# EAGLE design Lcd16x2_Backpack (EAGLE 9.2.2)
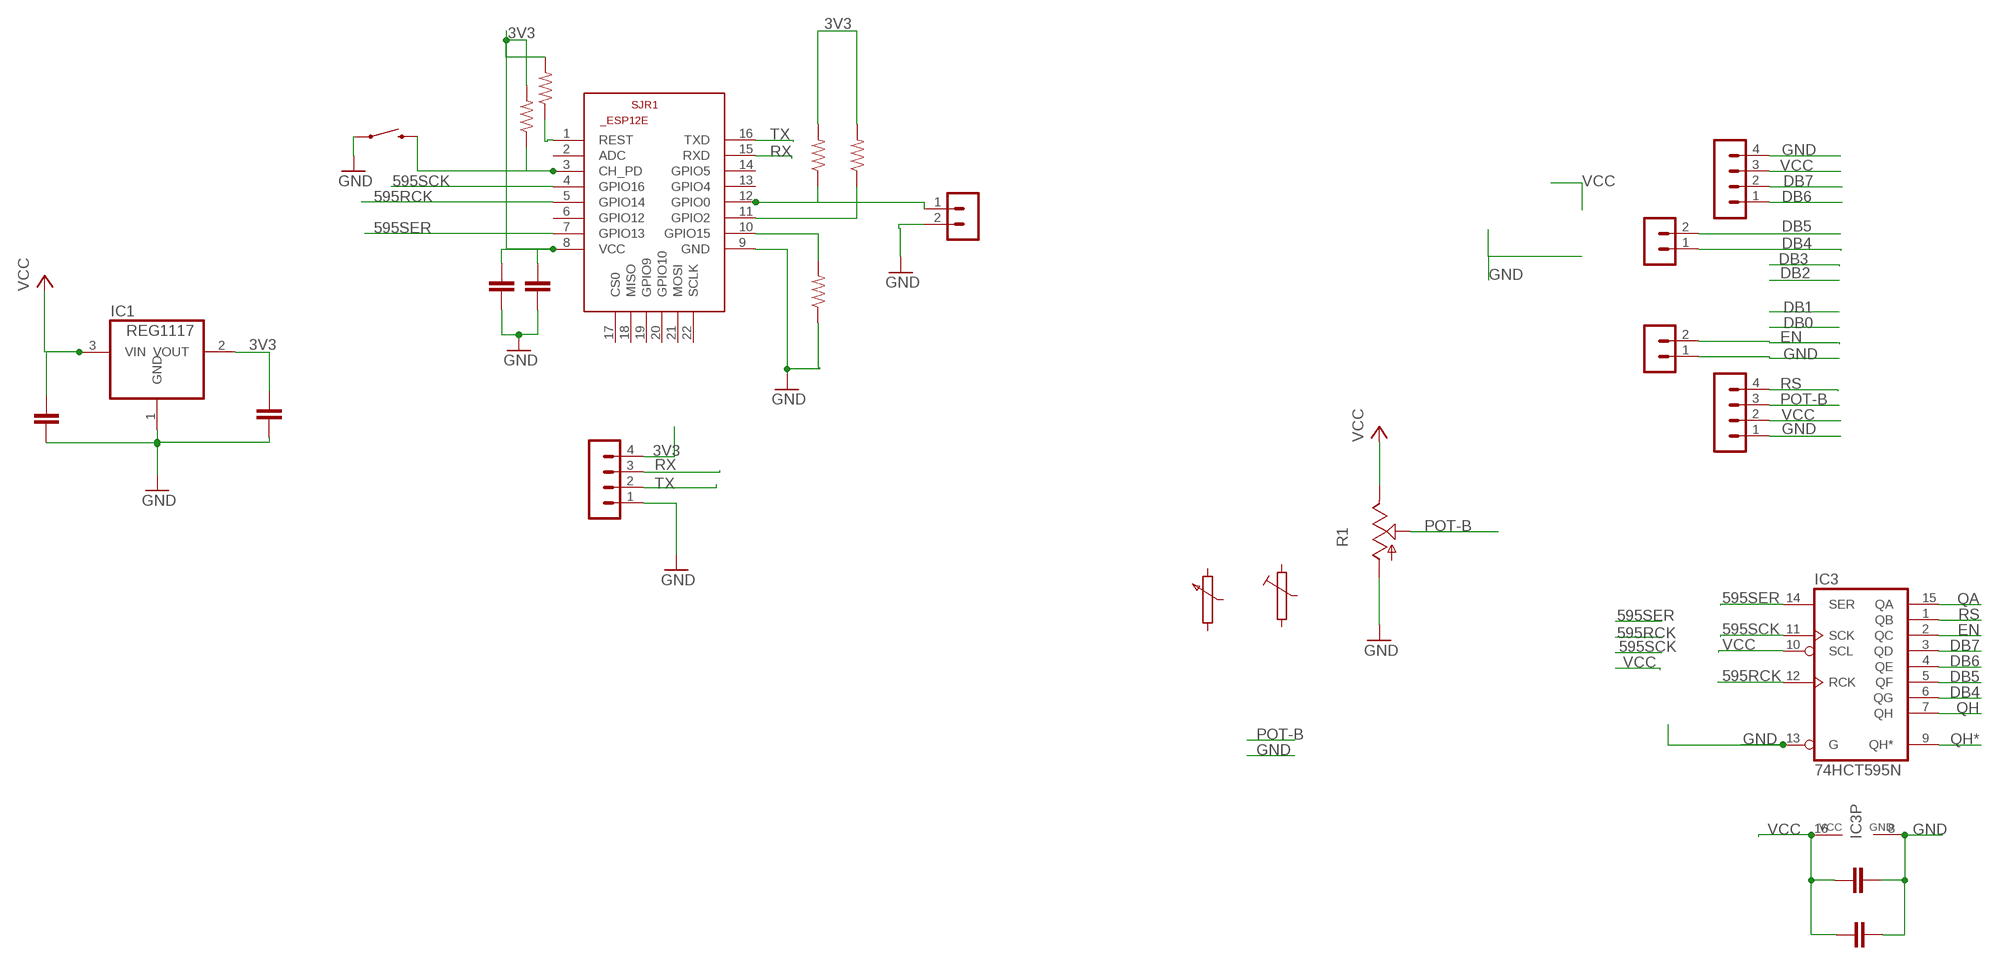
[diagram p0: schematic, sheet 1]

## Parts
IC1  REG1117  [SOT223]
IC3  74HCT595N  [DIL16]
R1  TRIM_US-RJ9W  [RJ9W]
SJR1  ESP8266-12EESP12E  [ESP8266-ESP12E]
U$1  RESISTOR-0.41206  [1206]
U$2  HEADER-4PIN  [HEADER-4PIN]
U$5  RESISTOR-0.41206  [1206]
U$6  RESISTOR-0.41206  [1206]
U$7  RESISTOR-0.41206  [1206]
U$8  RESISTOR-0.41206  [1206]
U$9  HEADER-4PIN  [HEADER-4PIN]
U$10  SWITCH-MOMENTARY  [TACTILE-6X6]
U$11  HEADER-2PINA  [HEADER-2PIN]
U$12  CAPACITOR-0.2-CER1206  [1206]
U$13  CAPACITOR-0.2-CER1206  [1206]
U$14  HEADER-2PINA  [HEADER-2PIN]
U$15  HEADER-4PIN  [HEADER-4PIN]
U$16  CAPACITOR-0.2-CER1206  [1206]
U$17  CAPACITOR-0.2-CER1206  [1206]
U$21  CAPACITOR-0.2-CER1206  [1206]
U$22  CAPACITOR-0.2-CER1206  [1206]
U$23  HEADER-2PINA  [HEADER-2PIN]

## Nets
3V3: IC1.2(VOUT) SJR1.8(VCC) U$5.2 U$6.2 U$7.2 U$8.2 U$9.4 U$13.2 U$16.2 U$17.2
595RCK: IC3.12(RCK) SJR1.5(GPIO14)
595SCK: IC3.11(SCK) SJR1.4(GPIO16)
595SER: IC3.14(SER) SJR1.7(GPIO13)
DB4: IC3.6(QG) U$14.1
DB5: IC3.5(QF) U$14.2
DB6: IC3.4(QE) U$2.1
DB7: IC3.3(QD) U$2.2
EN: IC3.2(QC) U$23.2
GND: IC1.1(GND) IC3.8(GND) IC3.13(G) R1.A SJR1.9(GND) U$1.1 U$2.4 U$9.1 U$10.1 U$10.2 U$11.2 U$12.1 U$13.1 U$15.1 U$16.1 U$17.1 U$21.2 U$22.2 U$23.1
N$1: SJR1.12(GPIO0) U$5.1 U$11.1
N$2: SJR1.11(GPIO2) U$6.1
N$3: SJR1.10(GPIO15) U$1.2
N$4: SJR1.1(REST) U$8.1
N$5: SJR1.3(CH_PD) U$7.1 U$10.3 U$10.4
POT-B: R1.S U$15.3
QA: IC3.15(QA)
QH: IC3.7(QH)
QH*: IC3.9(QH*)
RS: IC3.1(QB) U$15.4
RX: SJR1.15(RXD) U$9.3
TX: SJR1.16(TXD) U$9.2
VCC: IC1.3(VIN) IC3.10(SCL) IC3.16(VCC) R1.E U$2.3 U$12.2 U$15.2 U$21.1 U$22.1
Unconnected: SJR1.2(ADC) SJR1.6(GPIO12) SJR1.13(GPIO4) SJR1.14(GPIO5) SJR1.17(CS0) SJR1.18(MISO) SJR1.19(GPIO9) SJR1.20(GPIO10) SJR1.21(MOSI) SJR1.22(SCLK)

## Library data of the parts
IC1 = burr-brown:REG1117: 800mA and 1A Low Dropout (LDO) Positive Regulator 1.8V, 2.5V, 2.85V, 3.3V, 5V, and Adj; MPN: REG1117; OC_FARNELL: 1097566; OC_NEWARK: 14P6981
IC3 = 74xx-eu:74*595: 8-bit SHIFT REGISTER, output latch
R1 = pot:TRIM_US-: POTENTIOMETER
SJR1 = esp12e:ESP8266-12E: ESP8266-12E Library for Eagle CAD The author not responsible for any damages or errors!. Created by Suhail jr.lt;/author>
U$1 U$5-U$8 = GlennTamayoEagle:RESISTOR-0.4
U$2 U$9 U$15 = GlennTamayoEagle:HEADER-4PIN
U$10 = GlennTamayoEagle:SWITCH-MOMENTARY
U$11 U$14 U$23 = GlennTamayoEagle:HEADER-2PIN
U$12 U$13 U$16 U$17 U$21 U$22 = GlennTamayoEagle:CAPACITOR-0.2-CER

## Board
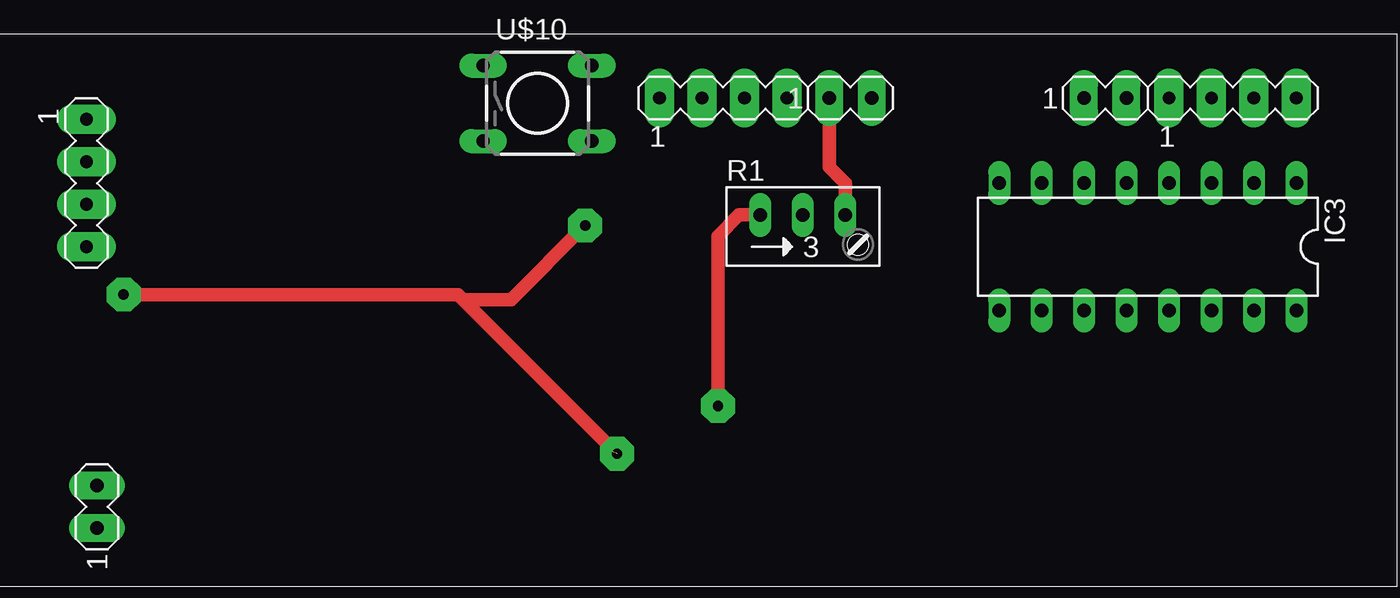
[diagram p1: board, top side]
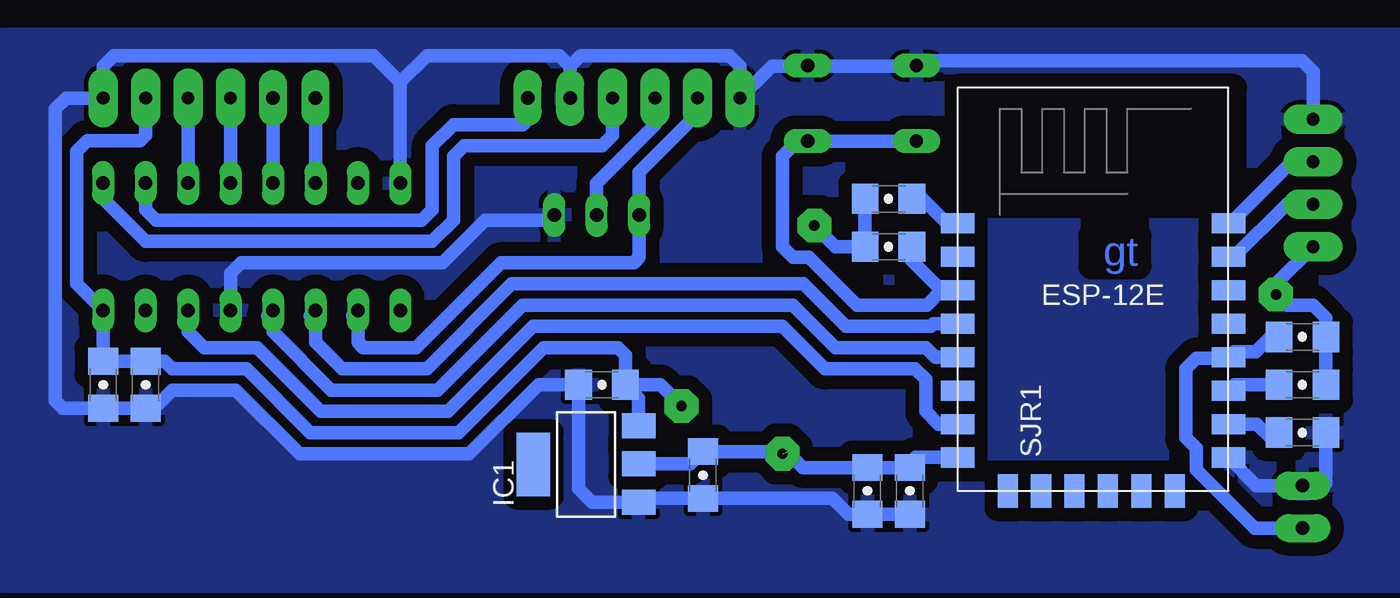
[diagram p2: board, bottom side, seen from below]

No outline drawn. Coordinates in mm, seen from the top.
Copper layers (1*16): Top 0.035mm / dielectric 1.5mm / Bottom 0.035mm
Design rules "default": minimum track width 10mil, minimum drill 24mil, track to track 8mil, track to pad 8mil, pad to pad 8mil, via to via 8mil, smd to smd 8mil, copper to edge 40mil, drill to drill 8mil, minimum pad ring 10mil, minimum via ring 8mil, stop-mask expansion 4mil, vias tented up to drill 0mil, thermal gap 10mil

### Footprints (pad centres in the part's own frame; a part is rotated, then mirrored left to right if it is on the bottom)
SOT223 = smd 1.499 x 2.007: 1 -2.261,-3.15; 2 0.025,-3.15; 3 2.311,-3.15 | smd 3.81 x 2.007: 4 0,3.15
DIL16 = drill 0.813 long: 1 -8.89,-3.81; 2 -6.35,-3.81; 3 -3.81,-3.81; 4 -1.27,-3.81; 5 1.27,-3.81; 6 3.81,-3.81; 7 6.35,-3.81; 8 8.89,-3.81; 9 8.89,3.81; 10 6.35,3.81; 11 3.81,3.81; 12 1.27,3.81; 13 -1.27,3.81; 14 -3.81,3.81; 15 -6.35,3.81; 16 -8.89,3.81
RJ9W = drill 0.813 long: A 2.54,0.635; E -2.54,0.635; S 0,0.635
ESP8266-ESP12E = smd 2 x 1.2: 1 -7.62,5.84; 2 -7.62,3.84; 3 -7.62,1.84; 4 -7.62,-0.16; 5 -7.62,-2.16; 6 -7.62,-4.16; 7 -7.62,-6.16; 8 -7.62,-8.16; 9 8.58,-8.16; 10 8.58,-6.16; 11 8.58,-4.16; 12 8.58,-2.16; 13 8.58,-0.16; 14 8.58,1.84; 15 8.58,3.84; 16 8.58,5.84 | smd 1.2 x 2: 17 -4.62,-10.16; 18 -2.62,-10.16; 19 -0.62,-10.16; 20 1.38,-10.16; 21 3.38,-10.16; 22 5.38,-10.16
1206 = smd 1.6 x 1.8: 1 -1.4,0; 2 1.4,0
HEADER-4PIN = drill 0.762 pad 1.778 long: 1 -3.81,0; 2 -1.27,0; 3 1.27,0; 4 3.81,0
TACTILE-6X6 = drill 0.8 pad 1.422 long: 1 -3.251,2.261; 2 3.251,2.261; 3 -3.251,-2.261; 4 3.251,-2.261
HEADER-2PIN = drill 0.813 pad 1.676 long: 1 -1.27,0; 2 1.27,0

### Placement (x,y rotation side)
IC1  48.9,7.3 90 bottom
IC3  68.9,20.32 180 top
R1  48.26,21.59 0 top
SJR1  19.05,15.88 0 bottom
U$1  6.03,9.21 180 bottom
U$2  73.98,29.21 0 top
U$5  6.03,14.92 0 bottom
U$6  6.03,12.06 0 bottom
U$7  30.8,20.32 180 bottom
U$8  30.8,23.18 180 bottom
U$9  5.4,24.13 270 top
U$10  32.38,28.89 0 top
U$11  6.03,4.76 90 top
U$12  47.94,12.06 0 bottom
U$13  41.91,6.67 90 bottom
U$14  66.36,29.21 0 top
U$15  43.5,29.21 0 top
U$16  32.07,5.71 90 bottom
U$17  29.53,5.71 90 bottom
U$21  75.25,12.06 270 bottom
U$22  77.79,12.06 270 bottom
U$23  51.12,29.21 0 top

### Tracks (layer width: path | path; a pad name or v marks a point on that pad's centre or on a via)
3V3  (via drill 0.61 pad 2.03)  (1 unrouted)
  Top 0.813: v7.62,17.46 27.62,17.46 27.94,17.14 | 27.94,17.14 30.8,17.14 v35.24,21.59 | 27.94,17.14 v37.15,7.94
  Bottom 0.813: U$6.2 U$5.2 4.63,16.06 5.4,16.83 6.99,16.83 v7.62,17.46 7.62,18.1 U$9.4 | IC1.2 42.65,7.33 U$13.2 36.87,8.07 35.91,7.12 U$16.2 U$17.2 29.21,7.43 29.21,7.53 29.18,7.71 SJR1.8 | 32.38,23.36 U$8.2 U$7.2 33.97,20.32 v35.24,21.59
595RCK
  Bottom 0.813: 67.94,16.19 IC3.12 67.63,15.24 64.14,11.75 57.78,11.75 52.7,16.83 36.51,16.83 33.97,14.29 28.57,14.29 28,13.71 SJR1.5
595SCK
  Bottom 0.813: 65.41,16.19 IC3.11 65.09,14.61 63.5,13.02 58.42,13.02 53.34,18.1 35.88,18.1 33.34,15.56 28.26,15.56 28.1,15.71 SJR1.4
595SER
  Bottom 0.813: SJR1.7 27.81,9.71 28.57,10.48 28.57,12.38 29.21,13.02 34.61,13.02 37.15,15.56 52.07,15.56 57.15,10.48 64.77,10.48 68.58,14.29 71.75,14.29 72.71,15.24 IC3.14
DB4
  Bottom 0.813: U$14.1 IC3.6
DB5
  Bottom 0.813: U$14.2 IC3.5
DB6
  Bottom 0.813: U$2.1 IC3.4
DB7
  Bottom 0.813: U$2.2 IC3.3
EN
  Bottom 0.813: IC3.2 75.25,22.54 74.61,21.91 58.74,21.91 58.1,22.54 58.1,26.35 56.83,27.62 52.7,27.62 52.39,27.94 U$23.2
GND
  Top 0.813: R1.A 50.8,24.13 49.85,25.08 U$23.1
  Bottom 0.813: U$1.1 4.63,6.16 4.76,6.03 U$11.2 8.79,6.03 SJR1.9 | IC3.8 60.01,30.16 | 60.01,30.16 58.42,31.75 50.48,31.75 49.85,31.11 | U$17.1 U$16.1 33.21,4.32 34.16,5.27 U$13.1 45.52,5.27 IC1.1 48.54,5.04 49.34,5.84 U$12.1 51.75,12.06 55.88,7.94 66.04,7.94 69.85,11.75 73.66,11.75 74.74,10.66 U$21.2 78.29,10.66 78.42,10.79 77.92,10.79 U$22.2 80.2,10.66 80.64,11.11 80.64,28.57 80.01,29.21 U$2.4 77.79,31.11 77.15,31.75 61.59,31.75 60.01,30.16 | U$9.1 5.4,30.8 6.03,31.43 28.85,31.43 U$10.1 29.17,31.11 37.78,31.11 U$15.1 39.69,31.11 40.32,31.75 49.21,31.75 49.85,31.11 | U$23.1 49.85,31.11 | IC3.13 70.17,18.73 69.53,19.37 57.47,19.37 54.93,21.91 51.12,21.91 R1.A
  pour Bottom (isolate 0.813): 0,0 83.82,0 83.82,33.02 0,33.02
N$1
  Bottom 0.813: U$5.1 7.94,14.92 8.83,14.03 10.15,14.03 SJR1.12 10.53,13.65 12.38,13.65 13.02,13.02 13.02,8.89 12.38,8.26 12.38,6.99 8.89,3.49 U$11.1
N$2
  Bottom 0.813: SJR1.11 10.12,12.06 U$6.1
N$3
  Bottom 0.813: SJR1.10 8.76,9.71 7.94,8.89 7.62,9.21 U$1.2
N$4
  Bottom 0.813: SJR1.1 27.3,21.71 28.76,23.18 U$8.1
N$5
  Bottom 0.813: 26.61,17.78 SJR1.3 27.62,17.71 | U$10.3 U$10.4 35.92,26.35 36.51,26.35 37.15,25.72 37.15,20.32 36.51,19.68 35.56,19.68 32.7,16.83 28.51,16.83 27.62,17.71 | 27.62,17.71 29.4,19.49 U$7.1
POT-B
  Bottom 0.813: 45.09,29.53 U$15.3 44.77,27.62 48.26,24.13 R1.S
RS
  Bottom 0.813: U$15.4 47.31,26.99 47.94,26.35 56.2,26.35 56.83,25.72 56.83,21.91 58.1,20.64 75.25,20.64 77.79,23.18 IC3.1
RX
  Bottom 0.813: SJR1.15 10.13,19.71 6.99,22.86 U$9.3
TX
  Bottom 0.813: SJR1.16 10.35,21.71 6.67,25.4 U$9.2
VCC  (via drill 0.61 pad 2.03)
  Top 0.813: v43.18,10.79 43.18,20.95 44.45,22.23 R1.E
  Bottom 0.813: U$21.1 75.12,13.34 | U$22.1 77.79,13.65 | U$22.1 IC3.16 79.38,18.1 79.38,26.04 78.74,26.67 75.56,26.67 75.25,26.99 U$2.3 | U$22.1 U$21.1 | 62.87,16.19 IC3.10 62.55,14.61 62.23,14.29 59.05,14.29 53.98,19.37 46.04,19.37 45.72,19.68 R1.E 45.72,24.77 42.55,27.94 42.55,28.89 U$15.2 | IC1.3 45.74,11.27 U$12.2 | U$12.2 46.54,13.84 46.99,14.29 51.44,14.29 56.52,9.21 65.41,9.21 69.22,13.02 73.66,13.02 74.11,13.46 U$21.1 | U$12.2 44.45,12.06 v43.18,10.79

### Text on the board
Bottom: gt